# Altium schematic sheet CAR_Amplifier.SchDoc
size 219 x 160 mm; SheetNumber: 1; SheetTotal: 1
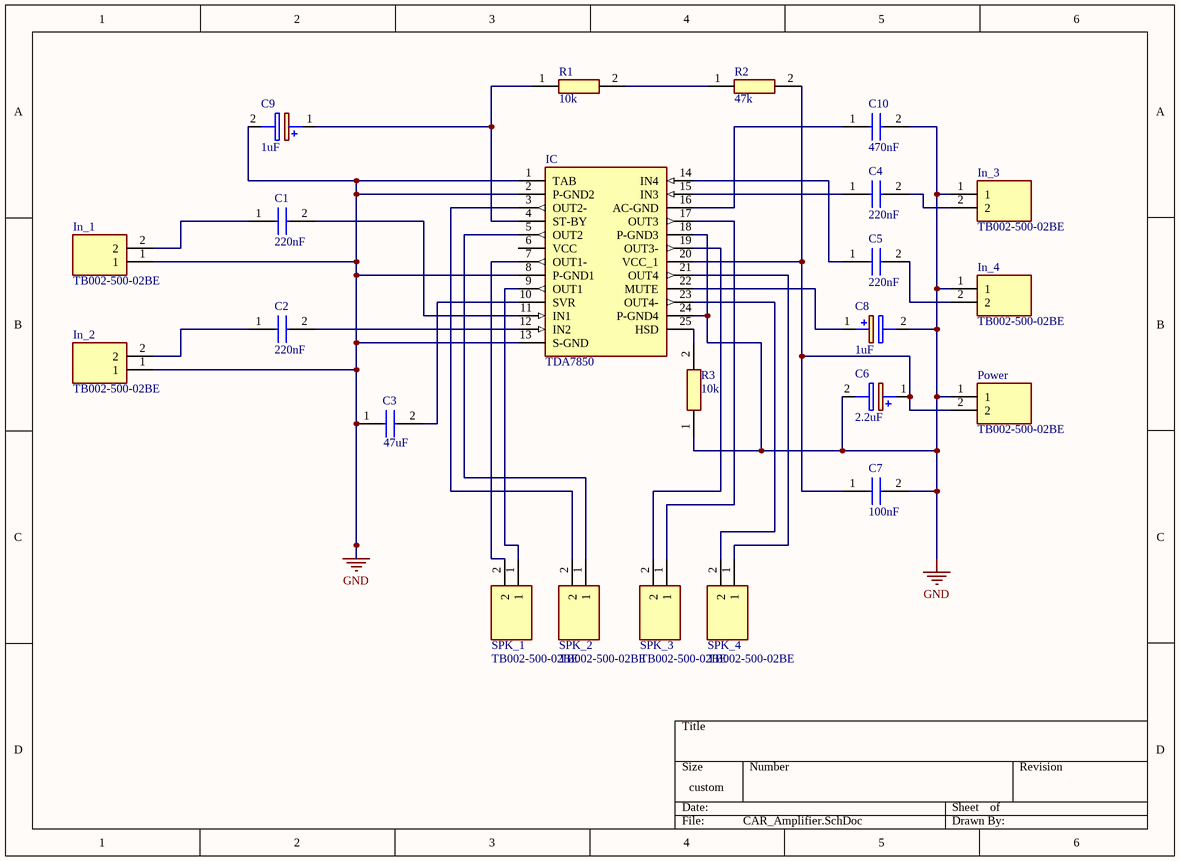
[diagram p0: CAR_Amplifier.SchDoc]

## Parts
C1  220nF  [C1210_FT]
C2  220nF  [C1210_FT]
C3  47uF  [FK20]
C4  220nF  [C1210_FT]
C5  220nF  [C1210_FT]
C6  2.2uF  [CAPAE420X610N]
C7  100nF  [CAPPA1420W55L380D260]
C8  1uF  [CAPAE430X550N]
C9  1uF  [CAPAE430X550N]
C10  470nF  [C1206]
IC  TDA7850  [TO100P465X2910X1977-25P]
In_1  TB002-500-02BE  [TB00250002BE]
In_2  TB002-500-02BE  [TB00250002BE]
In_3  TB002-500-02BE  [TB00250002BE]
In_4  TB002-500-02BE  [TB00250002BE]
Power  TB002-500-02BE  [TB00250002BE]
R1  10k  [RESC1608X55N]
R2  47k  [RESC1608X55N]
R3  10k  [RESC1608X55N]
SPK_1  TB002-500-02BE  [TB00250002BE]
SPK_2  TB002-500-02BE  [TB00250002BE]
SPK_3  TB002-500-02BE  [TB00250002BE]
SPK_4  TB002-500-02BE  [TB00250002BE]

## Nets
GND: C3.1 C6.2(-) C7.2(-) C8.2(-) C9.2(-) C10.2 IC.1(TAB) IC.2(P-GND2) IC.8(P-GND1) IC.13(S-GND) IC.18(P-GND3) IC.24(P-GND4) In_1.1 In_2.1 In_3.1 In_4.1 Power.1 R3.1
NetC1_1: C1.1 In_1.2
NetC1_2: C1.2 IC.11(IN1)
NetC2_1: C2.1 In_2.2
NetC2_2: C2.2 IC.12(IN2)
NetC3_2: C3.2 IC.10(SVR)
NetC4_1: C4.1 IC.15(IN3)
NetC4_2: C4.2 In_3.2
NetC5_1: C5.1 IC.14(IN4)
NetC5_2: C5.2 In_4.2
NetC6_1: C6.1(+) C7.1(+) IC.20(VCC_1) Power.2 R2.2
NetC8_1: C8.1(+) IC.22(MUTE)
NetC9_1: C9.1(+) IC.4(ST-BY) R1.1
NetC10_1: C10.1 IC.16(AC-GND)
NetIC_3: IC.3(OUT2-) SPK_2.2
NetIC_5: IC.5(OUT2) SPK_2.1
NetIC_7: IC.7(OUT1-) SPK_1.2
NetIC_9: IC.9(OUT1) SPK_1.1
NetIC_17: IC.17(OUT3) SPK_3.1
NetIC_19: IC.19(OUT3-) SPK_3.2
NetIC_21: IC.21(OUT4) SPK_4.1
NetIC_23: IC.23(OUT4-) SPK_4.2
NetIC_25: IC.25(HSD) R3.2
NetR1_2: R1.2 R2.1

Not connected (* = marked no-connect by the designer): IC 6(VCC)

## Library data of the parts
C1 C2 C4 C5 = C1210X224KARACAUTO: Capacitor; Manufacturer_Name: KEMET; Datasheet Link: https://content.kemet.com/datasheets/KEM_C1078_X7R_FT-CAP_AUTO_SMD.pdf; Manufacturer_Part_Number: C1210X224KARACAUTO; Mouser Part Number: 80-C1210X224KARAUTO; Mouser Price/Stock: https://www.mouser.co.uk/ProductDetail/KEMET/C1210X224KARACAUTO?qs=wnTfsH77Xs4S7Vc0Z3FaCA%3D%3D
C3 = FK20X5R0J476MN000: Capacitor; Manufacturer_Name: TDK; Datasheet Link: https://product.tdk.com/system/files/dam/doc/product/capacitor/ceramic/lead-mlcc/catalog/leadmlcc_conventional_fk_en.pdf; Height: 7mm; Manufacturer_Part_Number: FK20X5R0J476MN000
C6 = UWD1H2R2MCL1GS: Capacitor Polarised; Manufacturer_Name: Nichicon; Datasheet Link: https://datasheet.datasheetarchive.com/originals/dk/DKDS-9/176768.pdf; Height: 6.1mm; Manufacturer_Part_Number: UWD1H2R2MCL1GS
C7 = A104K15X7RF5UAAP: Capacitor; Manufacturer_Name: Vishay; Datasheet Link: https://www.vishay.com/docs/45249/apseries.pdf; Manufacturer_Part_Number: A104K15X7RF5UAAP; Mouser Part Number: 594-A104K15X7RF5UAAP; Mouser Price/Stock: https://www.mouser.co.uk/ProductDetail/Vishay-BC-Components/A104K15X7RF5UAAP?qs=DPoM0jnrROUJ7499VET5BQ%3D%3D
C8 C9 = 865080640001: Capacitor Polarised; Manufacturer_Name: Wurth Elektronik; Datasheet Link: https://www.we-online.com/catalog/datasheet/865080640001.pdf; Height: 5.5mm; Manufacturer_Part_Number: 865080640001; Mouser Part Number: 710-865080640001; Mouser Price/Stock: https://www.mouser.co.uk/ProductDetail/Wurth-Elektronik/865080640001?qs=0KOYDY2FL28T3O9R7owGdg%3D%3D
C10 = C1206C474K1REC7210: Capacitor; Manufacturer_Name: KEMET; Datasheet Link: https://content.kemet.com/datasheets/KEM_C1090_X7R_ESD.pdf; Manufacturer_Part_Number: C1206C474K1REC7210; Mouser Part Number: 80-C1206C474K1RECLR; Mouser Price/Stock: https://www.mouser.co.uk/ProductDetail/KEMET/C1206C474K1REC7210?qs=55YtniHzbhCc12xecGnQhw%3D%3D
IC = TDA7850: Integrated Circuit; Manufacturer_Name: STMicroelectronics; Datasheet Link: http://www.st.com/web/en/resource/technical/document/datasheet/CD00145702.pdf; Height: 4.65mm; Manufacturer_Part_Number: TDA7850; Mouser Part Number: 511-TDA7850; Mouser Price/Stock: https://www.mouser.co.uk/ProductDetail/STMicroelectronics/TDA7850?qs=VJaATVMq%252BXpapg7tNDopRA%3D%3D; Arrow Part Number: TDA7850; Arrow Price/Stock: https://www.arrow.com/en/products/tda7850/stmicroelectronics?region=nac
In_1-In_4 Power SPK_1-SPK_4 = TB002-500-02BE: Connector; Manufacturer_Name: CUI Devices; Datasheet Link: https://eu.mouser.com/datasheet/2/670/tb002_500-1550579.pdf; Height: 10.4mm; Manufacturer_Part_Number: TB002-500-02BE; Mouser Part Number: 490-TB002-500-02BE; Mouser Price/Stock: https://www.mouser.co.uk/ProductDetail/CUI-Devices/TB002-500-02BE?qs=vLWxofP3U2x9716kcgva%2Fw%3D%3D; Arrow Part Number: TB002-500-02BE; Arrow Price/Stock: https://www.arrow.com/en/products/tb002-500-02be/cui-devices?region=nac
R1 R3 = MCT06030D1002DP500: Resistor; Manufacturer_Name: Vishay; Datasheet Link: http://www.vishay.com/docs/28705/mcx0x0xpro.pdf; Height: 0.55mm; Manufacturer_Part_Number: MCT06030D1002DP500; Mouser Part Number: 594-MCT06030D1002DP5; Mouser Price/Stock: https://www.mouser.co.uk/ProductDetail/Vishay-Beyschlag/MCT06030D1002DP500?qs=2UBm2ZpWbY4LmLEyOhD%252Bvw%3D%3D; Arrow Part Number: MCT06030D1002DP500; Arrow Price/Stock: https://www.arrow.com/en/products/mct06030d1002dp500/vishay?region=nac
R2 = MCT06030C4702FP500: Resistor; Manufacturer_Name: Vishay; Datasheet Link: http://www.vishay.com/docs/28705/mcx0x0xpro.pdf; Height: 0.55mm; Manufacturer_Part_Number: MCT06030C4702FP500; Mouser Part Number: 594-MCT06030C4702FP5; Mouser Price/Stock: https://www.mouser.co.uk/ProductDetail/Vishay-Beyschlag/MCT06030C4702FP500?qs=7ZE6F4QMOBa8uKZSFemjDw%3D%3D